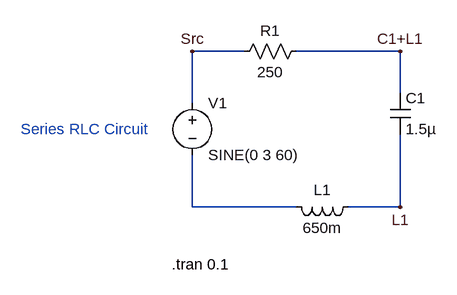
[diagram p0: schematic RLC_Series.asc]
RLC_Series.asc, the LTspice schematic file:
Version 4.1
SHEET 1 880 680
WIRE 96 48 16 48
WIRE 336 48 176 48
WIRE 336 112 336 48
WIRE 16 128 16 48
WIRE 16 288 16 208
WIRE 176 288 16 288
WIRE 336 288 336 176
WIRE 336 288 256 288
FLAG 16 48 Src
FLAG 336 48 C1+L1
FLAG 336 288 L1
SYMBOL res 192 32 R90
WINDOW 0 0 56 VBottom 2
WINDOW 3 32 56 VTop 2
SYMATTR InstName R1
SYMATTR Value 250
SYMBOL cap 320 112 R0
SYMATTR InstName C1
SYMATTR Value 1.5µ
SYMBOL ind 272 272 R90
WINDOW 0 5 56 VBottom 2
WINDOW 3 32 56 VTop 2
SYMATTR InstName L1
SYMATTR Value 650m
SYMATTR SpiceLine Rser=1m
SYMBOL voltage 16 112 R0
WINDOW 123 0 0 Left 0
WINDOW 39 0 0 Left 0
SYMATTR InstName V1
SYMATTR Value SINE(0 3 60)
TEXT -16 376 Left 2 !.tran 0.1
TEXT -248 168 Left 2 ;Series RLC Circuit

The netlist it stands for:
* RLC_Series.asc
R1 C1+L1 Src 250
C1 C1+L1 L1 1.5µ
L1 L1 N001 650m Rser=1m
V1 Src N001 SINE(0 3 60)
.tran 0.1
* Series RLC Circuit
.backanno
.end